# Altium schematic sheet Slot_1b.SchDoc: CPCI-Serial Backplane
size 420 x 297 mm; Date: 05/04/2023; CheckedBy: EG; GD; GK; MS; DrawnBy: M. Gąska; Address1: European Organization for Nuclear Research; Address2: CH-1211 Geneve 23 - Switzerland; DocumentNumber: 3; Revision: 2; SheetNumber: 3; SheetTotal: 5; Projet: DI/OT Crate; DivGrp: BE-CO; Title2: Slot 1b; Designer: G.Daniluk; ModifiedBy: J.Kuhn; CreateDate: 05/04/2023; CheckedDate: 05/04/2023
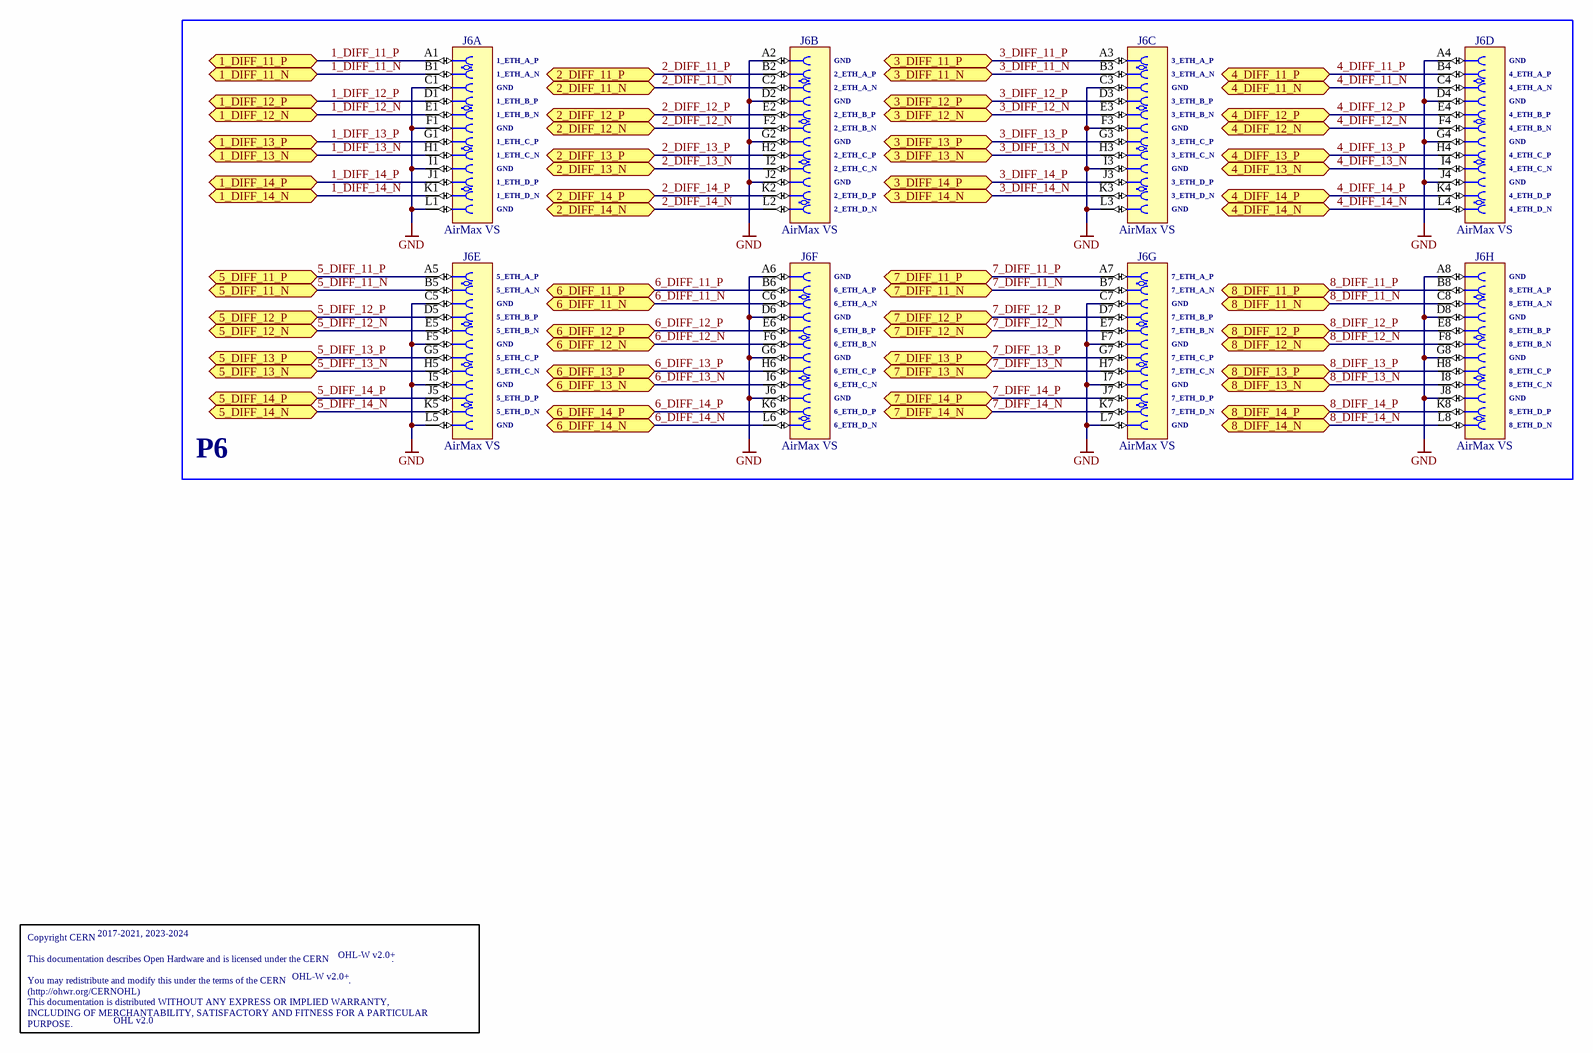
[diagram p0: Slot_1b.SchDoc]

## Parts
CERN_OHL  CERN_OHL  [CERN_OHL]  (value not drawn)  (graphical)
J6  AirMax VS  [AMPHENOL_10052842-101LF]  (parts A,B,C,D,E,F,G,H of 8)

## Blocks framed on the sheet
P6: J6

## Ports
1_DIFF_11_N (bidir), 1_DIFF_11_P (bidir), 1_DIFF_12_N (bidir), 1_DIFF_12_P (bidir), 1_DIFF_13_N (bidir), 1_DIFF_13_P (bidir), 1_DIFF_14_N (bidir), 1_DIFF_14_P (bidir), 2_DIFF_11_N (bidir), 2_DIFF_11_P (bidir), 2_DIFF_12_N (bidir), 2_DIFF_12_P (bidir), 2_DIFF_13_N (bidir), 2_DIFF_13_P (bidir), 2_DIFF_14_N (bidir), 2_DIFF_14_P (bidir), 3_DIFF_11_N (bidir), 3_DIFF_11_P (bidir), 3_DIFF_12_N (bidir), 3_DIFF_12_P (bidir), 3_DIFF_13_N (bidir), 3_DIFF_13_P (bidir), 3_DIFF_14_N (bidir), 3_DIFF_14_P (bidir), 4_DIFF_11_N (bidir), 4_DIFF_11_P (bidir), 4_DIFF_12_N (bidir), 4_DIFF_12_P (bidir), 4_DIFF_13_N (bidir), 4_DIFF_13_P (bidir), 4_DIFF_14_N (bidir), 4_DIFF_14_P (bidir), 5_DIFF_11_N (bidir), 5_DIFF_11_P (bidir), 5_DIFF_12_N (bidir), 5_DIFF_12_P (bidir), 5_DIFF_13_N (bidir), 5_DIFF_13_P (bidir), 5_DIFF_14_N (bidir), 5_DIFF_14_P (bidir), 6_DIFF_11_N (bidir), 6_DIFF_11_P (bidir), 6_DIFF_12_N (bidir), 6_DIFF_12_P (bidir), 6_DIFF_13_N (bidir), 6_DIFF_13_P (bidir), 6_DIFF_14_N (bidir), 6_DIFF_14_P (bidir), 7_DIFF_11_N (bidir), 7_DIFF_11_P (bidir), 7_DIFF_12_N (bidir), 7_DIFF_12_P (bidir), 7_DIFF_13_N (bidir), 7_DIFF_13_P (bidir), 7_DIFF_14_N (bidir), 7_DIFF_14_P (bidir), 8_DIFF_11_N (bidir), 8_DIFF_11_P (bidir), 8_DIFF_12_N (bidir), 8_DIFF_12_P (bidir), 8_DIFF_13_N (bidir), 8_DIFF_13_P (bidir), 8_DIFF_14_N (bidir), 8_DIFF_14_P (bidir)

## Nets
GND: J6.A2 J6.A4 J6.A6 J6.A8 J6.C1 J6.C3 J6.C5 J6.C7 J6.D2 J6.D4 J6.D6 J6.D8 J6.F1 J6.F3 J6.F5 J6.F7 J6.G2 J6.G4 J6.G6 J6.G8 J6.I1 J6.I3 J6.I5 J6.I7 J6.J2 J6.J4 J6.J6 J6.J8 J6.L1 J6.L3 J6.L5 J6.L7
1_DIFF_11_N: J6.B1 ; port 1_DIFF_11_N
1_DIFF_11_P: J6.A1 ; port 1_DIFF_11_P
1_DIFF_12_N: J6.E1 ; port 1_DIFF_12_N
1_DIFF_12_P: J6.D1 ; port 1_DIFF_12_P
1_DIFF_13_N: J6.H1 ; port 1_DIFF_13_N
1_DIFF_13_P: J6.G1 ; port 1_DIFF_13_P
1_DIFF_14_N: J6.K1 ; port 1_DIFF_14_N
1_DIFF_14_P: J6.J1 ; port 1_DIFF_14_P
2_DIFF_11_N: J6.C2 ; port 2_DIFF_11_N
2_DIFF_11_P: J6.B2 ; port 2_DIFF_11_P
2_DIFF_12_N: J6.F2 ; port 2_DIFF_12_N
2_DIFF_12_P: J6.E2 ; port 2_DIFF_12_P
2_DIFF_13_N: J6.I2 ; port 2_DIFF_13_N
2_DIFF_13_P: J6.H2 ; port 2_DIFF_13_P
2_DIFF_14_N: J6.L2 ; port 2_DIFF_14_N
2_DIFF_14_P: J6.K2 ; port 2_DIFF_14_P
3_DIFF_11_N: J6.B3 ; port 3_DIFF_11_N
3_DIFF_11_P: J6.A3 ; port 3_DIFF_11_P
3_DIFF_12_N: J6.E3 ; port 3_DIFF_12_N
3_DIFF_12_P: J6.D3 ; port 3_DIFF_12_P
3_DIFF_13_N: J6.H3 ; port 3_DIFF_13_N
3_DIFF_13_P: J6.G3 ; port 3_DIFF_13_P
3_DIFF_14_N: J6.K3 ; port 3_DIFF_14_N
3_DIFF_14_P: J6.J3 ; port 3_DIFF_14_P
4_DIFF_11_N: J6.C4 ; port 4_DIFF_11_N
4_DIFF_11_P: J6.B4 ; port 4_DIFF_11_P
4_DIFF_12_N: J6.F4 ; port 4_DIFF_12_N
4_DIFF_12_P: J6.E4 ; port 4_DIFF_12_P
4_DIFF_13_N: J6.I4 ; port 4_DIFF_13_N
4_DIFF_13_P: J6.H4 ; port 4_DIFF_13_P
4_DIFF_14_N: J6.L4 ; port 4_DIFF_14_N
4_DIFF_14_P: J6.K4 ; port 4_DIFF_14_P
5_DIFF_11_N: J6.B5 ; port 5_DIFF_11_N
5_DIFF_11_P: J6.A5 ; port 5_DIFF_11_P
5_DIFF_12_N: J6.E5 ; port 5_DIFF_12_N
5_DIFF_12_P: J6.D5 ; port 5_DIFF_12_P
5_DIFF_13_N: J6.H5 ; port 5_DIFF_13_N
5_DIFF_13_P: J6.G5 ; port 5_DIFF_13_P
5_DIFF_14_N: J6.K5 ; port 5_DIFF_14_N
5_DIFF_14_P: J6.J5 ; port 5_DIFF_14_P
6_DIFF_11_N: J6.C6 ; port 6_DIFF_11_N
6_DIFF_11_P: J6.B6 ; port 6_DIFF_11_P
6_DIFF_12_N: J6.F6 ; port 6_DIFF_12_N
6_DIFF_12_P: J6.E6 ; port 6_DIFF_12_P
6_DIFF_13_N: J6.I6 ; port 6_DIFF_13_N
6_DIFF_13_P: J6.H6 ; port 6_DIFF_13_P
6_DIFF_14_N: J6.L6 ; port 6_DIFF_14_N
6_DIFF_14_P: J6.K6 ; port 6_DIFF_14_P
7_DIFF_11_N: J6.B7 ; port 7_DIFF_11_N
7_DIFF_11_P: J6.A7 ; port 7_DIFF_11_P
7_DIFF_12_N: J6.E7 ; port 7_DIFF_12_N
7_DIFF_12_P: J6.D7 ; port 7_DIFF_12_P
7_DIFF_13_N: J6.H7 ; port 7_DIFF_13_N
7_DIFF_13_P: J6.G7 ; port 7_DIFF_13_P
7_DIFF_14_N: J6.K7 ; port 7_DIFF_14_N
7_DIFF_14_P: J6.J7 ; port 7_DIFF_14_P
8_DIFF_11_N: J6.C8 ; port 8_DIFF_11_N
8_DIFF_11_P: J6.B8 ; port 8_DIFF_11_P
8_DIFF_12_N: J6.F8 ; port 8_DIFF_12_N
8_DIFF_12_P: J6.E8 ; port 8_DIFF_12_P
8_DIFF_13_N: J6.I8 ; port 8_DIFF_13_N
8_DIFF_13_P: J6.H8 ; port 8_DIFF_13_P
8_DIFF_14_N: J6.L8 ; port 8_DIFF_14_N
8_DIFF_14_P: J6.K8 ; port 8_DIFF_14_P

## Notes on the sheet
- (near J6) 1_ETH_A_P
- (near J6) 1_ETH_A_N
- (near J6) 1_ETH_B_P
- (near J6) 1_ETH_B_N
- (near J6) GND
- (near J6) 2_ETH_B_P
- (near J6) 2_ETH_A_N
- (near J6) 2_ETH_A_P
- (near J6) 3_ETH_B_P
- (near J6) 3_ETH_B_N
- (near J6) 3_ETH_A_N
- (near J6) 3_ETH_A_P
- (near J6) 4_ETH_B_P
- (near J6) 4_ETH_A_N
- (near J6) 4_ETH_A_P
- (near J6) 1_ETH_C_P
- (near J6) 1_ETH_C_N
- (near J6) 1_ETH_D_P
- (near J6) 2_ETH_C_N
- (near J6) 2_ETH_C_P
- (near J6) 2_ETH_B_N
- (near J6) 3_ETH_D_P
- (near J6) 3_ETH_C_P
- (near J6) 3_ETH_C_N
- (near J6) 4_ETH_C_N
- (near J6) 4_ETH_C_P
- (near J6) 4_ETH_B_N
- (near J6) 1_ETH_D_N
- (near J6) 2_ETH_D_N
- (near J6) 2_ETH_D_P
- (near J6) 3_ETH_D_N
- (near J6) 4_ETH_D_N
- (near J6) 4_ETH_D_P
- (near J6) 5_ETH_B_P
- (near J6) 5_ETH_A_N
- (near J6) 5_ETH_A_P
- (near J6) 6_ETH_A_N
- (near J6) 6_ETH_A_P
- (near J6) 7_ETH_B_P
- (near J6) 7_ETH_A_N
- (near J6) 7_ETH_A_P
- (near J6) 8_ETH_A_P
- (near J6) 8_ETH_A_N
- (near J6) 5_ETH_C_N
- (near J6) 5_ETH_C_P
- (near J6) 5_ETH_B_N
- (near J6) 6_ETH_C_N
- (near J6) 6_ETH_C_P
- (near J6) 6_ETH_B_N
- (near J6) 6_ETH_B_P
- (near J6) 7_ETH_C_N
- (near J6) 7_ETH_C_P
- (near J6) 7_ETH_B_N
- (near J6) 8_ETH_B_P
- (near J6) 8_ETH_B_N
- (near J6) 8_ETH_C_P
- (near J6) 8_ETH_C_N
- (near J6) 5_ETH_D_N
- (near J6) 5_ETH_D_P
- (near J6) 6_ETH_D_N
- (near J6) 6_ETH_D_P
- (near J6) 7_ETH_D_N
- (near J6) 7_ETH_D_P
- (near J6) 8_ETH_D_P
- (near J6) 8_ETH_D_N
- Project/Equipment
- Document
- Designer
- Drawn by
- Check.by
- File
- Last Mod.
- Print Date
- Sheet
- Size
- A3
- of
- Rev
- (in symbol CERN_OHL) Copyright CERN / This documentation describes Open Hardware and is licensed under the CERN                         . / You may redistribute and modify this under the terms of the CERN                         . / (http://ohwr.org/CERNOHL) / This documentation is distributed WITHOUT ANY EXPRESS OR IMPLIED WARRANTY, / INCLUDING OF MERCHANTABILITY, SATISFACTORY AND FITNESS FOR A PARTICULAR PURPOSE. / Please see the CERN                   for applicable conditions.

## Library data of the parts
CERN_OHL = CERN_OHL: Part Description: Copyright CERN; OHL_License: OHL-W v2.0+; OHL_Version: OHL v2.0; Mounted: No; OHL_Date: 2017-2021, 2023-2024; Part Number: CERN_OHL; Component Type: Standard (No BOM); Pin Count: 0; Socket: No; SMD: No; Sense: No; Status: None; ComponentHeight: 0mm; HelpURL: Undefined; Author: CERN DEM HF; CreateDate: 03/12/2021; LatestRevisionDate: 03/12/2021; PackageDescription: Texte Copyright Cern
J6 = AMPHENOL_10052842-101LF: 96 Contacts Receptacle, 8 Columns, 4 Pairs per Column; Part Description: 96 Contacts, 2mm Pitch, 8 Columns, 4 Pairs per Column, Vertical Receptacle; Part Number: AMPHENOL_10052842-101LF; Component Kind: Standard; Component Type: Standard; Pin Count: 96; Family: AirMax VS; Mounted: Yes; Socket: No; SMD: No; PressFit: Yes; Sense: No; Status: None; Manufacturer: AMPHENOL; Manufacturer Part Number: 10052842-101LF; ComponentHeight: 10.85mm; HelpURL: \\cern.ch\dfs\Applications\Altium\Datasheets\AMPHENOL_10052842-101LF.pdf; ComponentLink1URL: \\cern.ch\dfs\Applications\Altium\Datasheets\AMPHENOL_10052842-101LF_Application.pdf; ComponentLink1Description: Application; Author: CERN DEM MR; CreateDate: 30.04.2019; LatestRevisionDate: 30.04.2019